# Altium schematic sheet Power.SchDoc
size A4
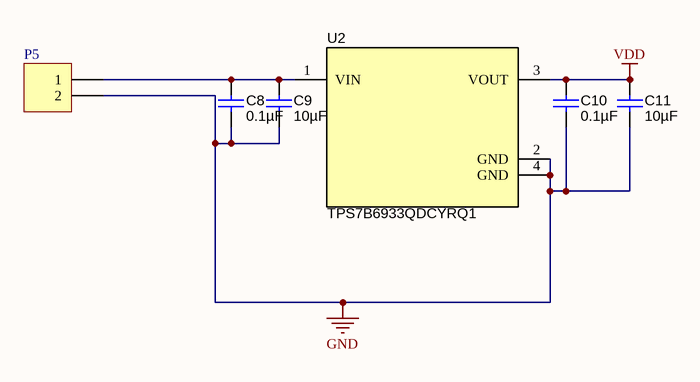
[diagram p0: Power.SchDoc]

## Parts
C8  ValueDisplayed: 0.1µF  [0603L]  (hidden comment: C0603C104J4RACTU)
C9  ValueDisplayed: 10µF  [1210L]  (hidden comment: GRM32ER71H106KA12L)
C10  ValueDisplayed: 0.1µF  [0603L]  (hidden comment: C0603C104J4RACTU)
C11  ValueDisplayed: 10µF  [1210L]  (hidden comment: GRM32ER71H106KA12L)
P5  (no value)  [HDR1X2]
U2  TPS7B6933QDCYRQ1  [DCY0004A_N]

## Nets
GND: C8.2 C9.2 C10.2 C11.2 P5.2 U2.2(GND) U2.4(GND)
VDD: C10.1 C11.1 U2.3(VOUT)
NetC8_1: C8.1 C9.1 P5.1 U2.1(VIN)

## Library data of the parts
C8 C10 = C0603C104J4RACTU: CAP, CERM, 0.1 µF, 16 V, +/- 5%, X7R, 0603; Manufacturer: Kemet; Polarized: N; CompType: Capacitor; Value: 0.1uF; U/M: EA; Cap_F: 0.0000001; Tolerance_%: 5; Value1: Unknown; VDC_V: 16; Value2: 16V; TaMin_C: -55; TaMax_C: 125; Cap_Case: 0603; AEC Category: Q200; SymbolVersion: 2008-07-09; PartNumber: C0603C104J4RACTU; PackageReference: 0603; RoHS: Y; MountType: SMT; Technology: Ceramic; TempCo: X7R; Published: 2008-06-19; Publisher: Texas Instruments; LatestRevisionDate: 2015-12-04; ComponentLink1Description: Datasheet link; ComponentLink1URL: http://www.kemet.com/kemet/web/homepage/kechome.nsf/vapubfiles/F3102_Y5V.pdf/$file/F3102_Y5V.pdf; Supplier 1: Digi-Key; Supplier Part Number 1: 399-1097-1-ND; Supplier 2: Mouser; Supplier Part Number 2: 80-C0603C104J4R; Supplier 3: Farnell; Supplier Part Number 3: 1650834; AEC Qualified: ?
C9 C11 = GRM32ER71H106KA12L: CAP, CERM, 10 µF, 50 V, +/- 10%, X7R, 1210; Manufacturer: MuRata; Polarized: N; CompType: Capacitor; Value: 10uF; U/M: EA; Cap_F: 0.00001; Tolerance_%: 10; Value1: Unknown; VDC_V: 50; Value2: 50V; TaMin_C: -55; TaMax_C: 125; Cap_Case: 1210; AEC Category: Q200; SymbolVersion: 2008-07-09; PartNumber: GRM32ER71H106KA12L; PackageReference: 1210; RoHS: Y; MountType: SMT; Technology: Ceramic; TempCo: X7R; Published: 2008-06-19; Publisher: Texas Instruments; LatestRevisionDate: 2015-12-04; ComponentLink1Description: Datasheet link; ComponentLink1URL: http://www.murata.com/products/catalog/pdf/c02e.pdf; Supplier 1: Digi-Key; Supplier Part Number 1: 490-6544-1-ND; Supplier 2: Mouser; Supplier Part Number 2: 81-GRM32ER71H106KA2L; AEC Qualified: ?
P5 = Header 2: Header, 2-Pin; LatestRevisionDate: 17-Jul-2002; LatestRevisionNote: Re-released for DXP Platform.; Publisher: Altium Limited
U2 = TPS7B6933QDCYRQ1: High Voltage Ultra Low Iq - Low Drop Out Regulator, DCY0004A; Manufacturer: Texas Instruments; SymbolCreator: Altium; CompType: IC; U/M: EA; SymbolVersion: 2014-08-05; PartNumber: TPS7B6933QDCYRQ1; PackageReference: DCY0004A; MountType: SMT; ComponentLink1Description: Datasheet Link; ComponentLink1URL: http://www.ti.com/lit/ds/symlink/tps7b6933-q1.pdf; Publisher: Texas Instruments; LatestRevisionDate: 2015-12-29; Alternate Manufacturer: Texas Instruments